# EasyEDA schematic ir_homekit_1.0.json
TITLE: Sheet_1; REV: 1.0; Date: 2022-09-18; Sheet: 1/1; Company: Your Company
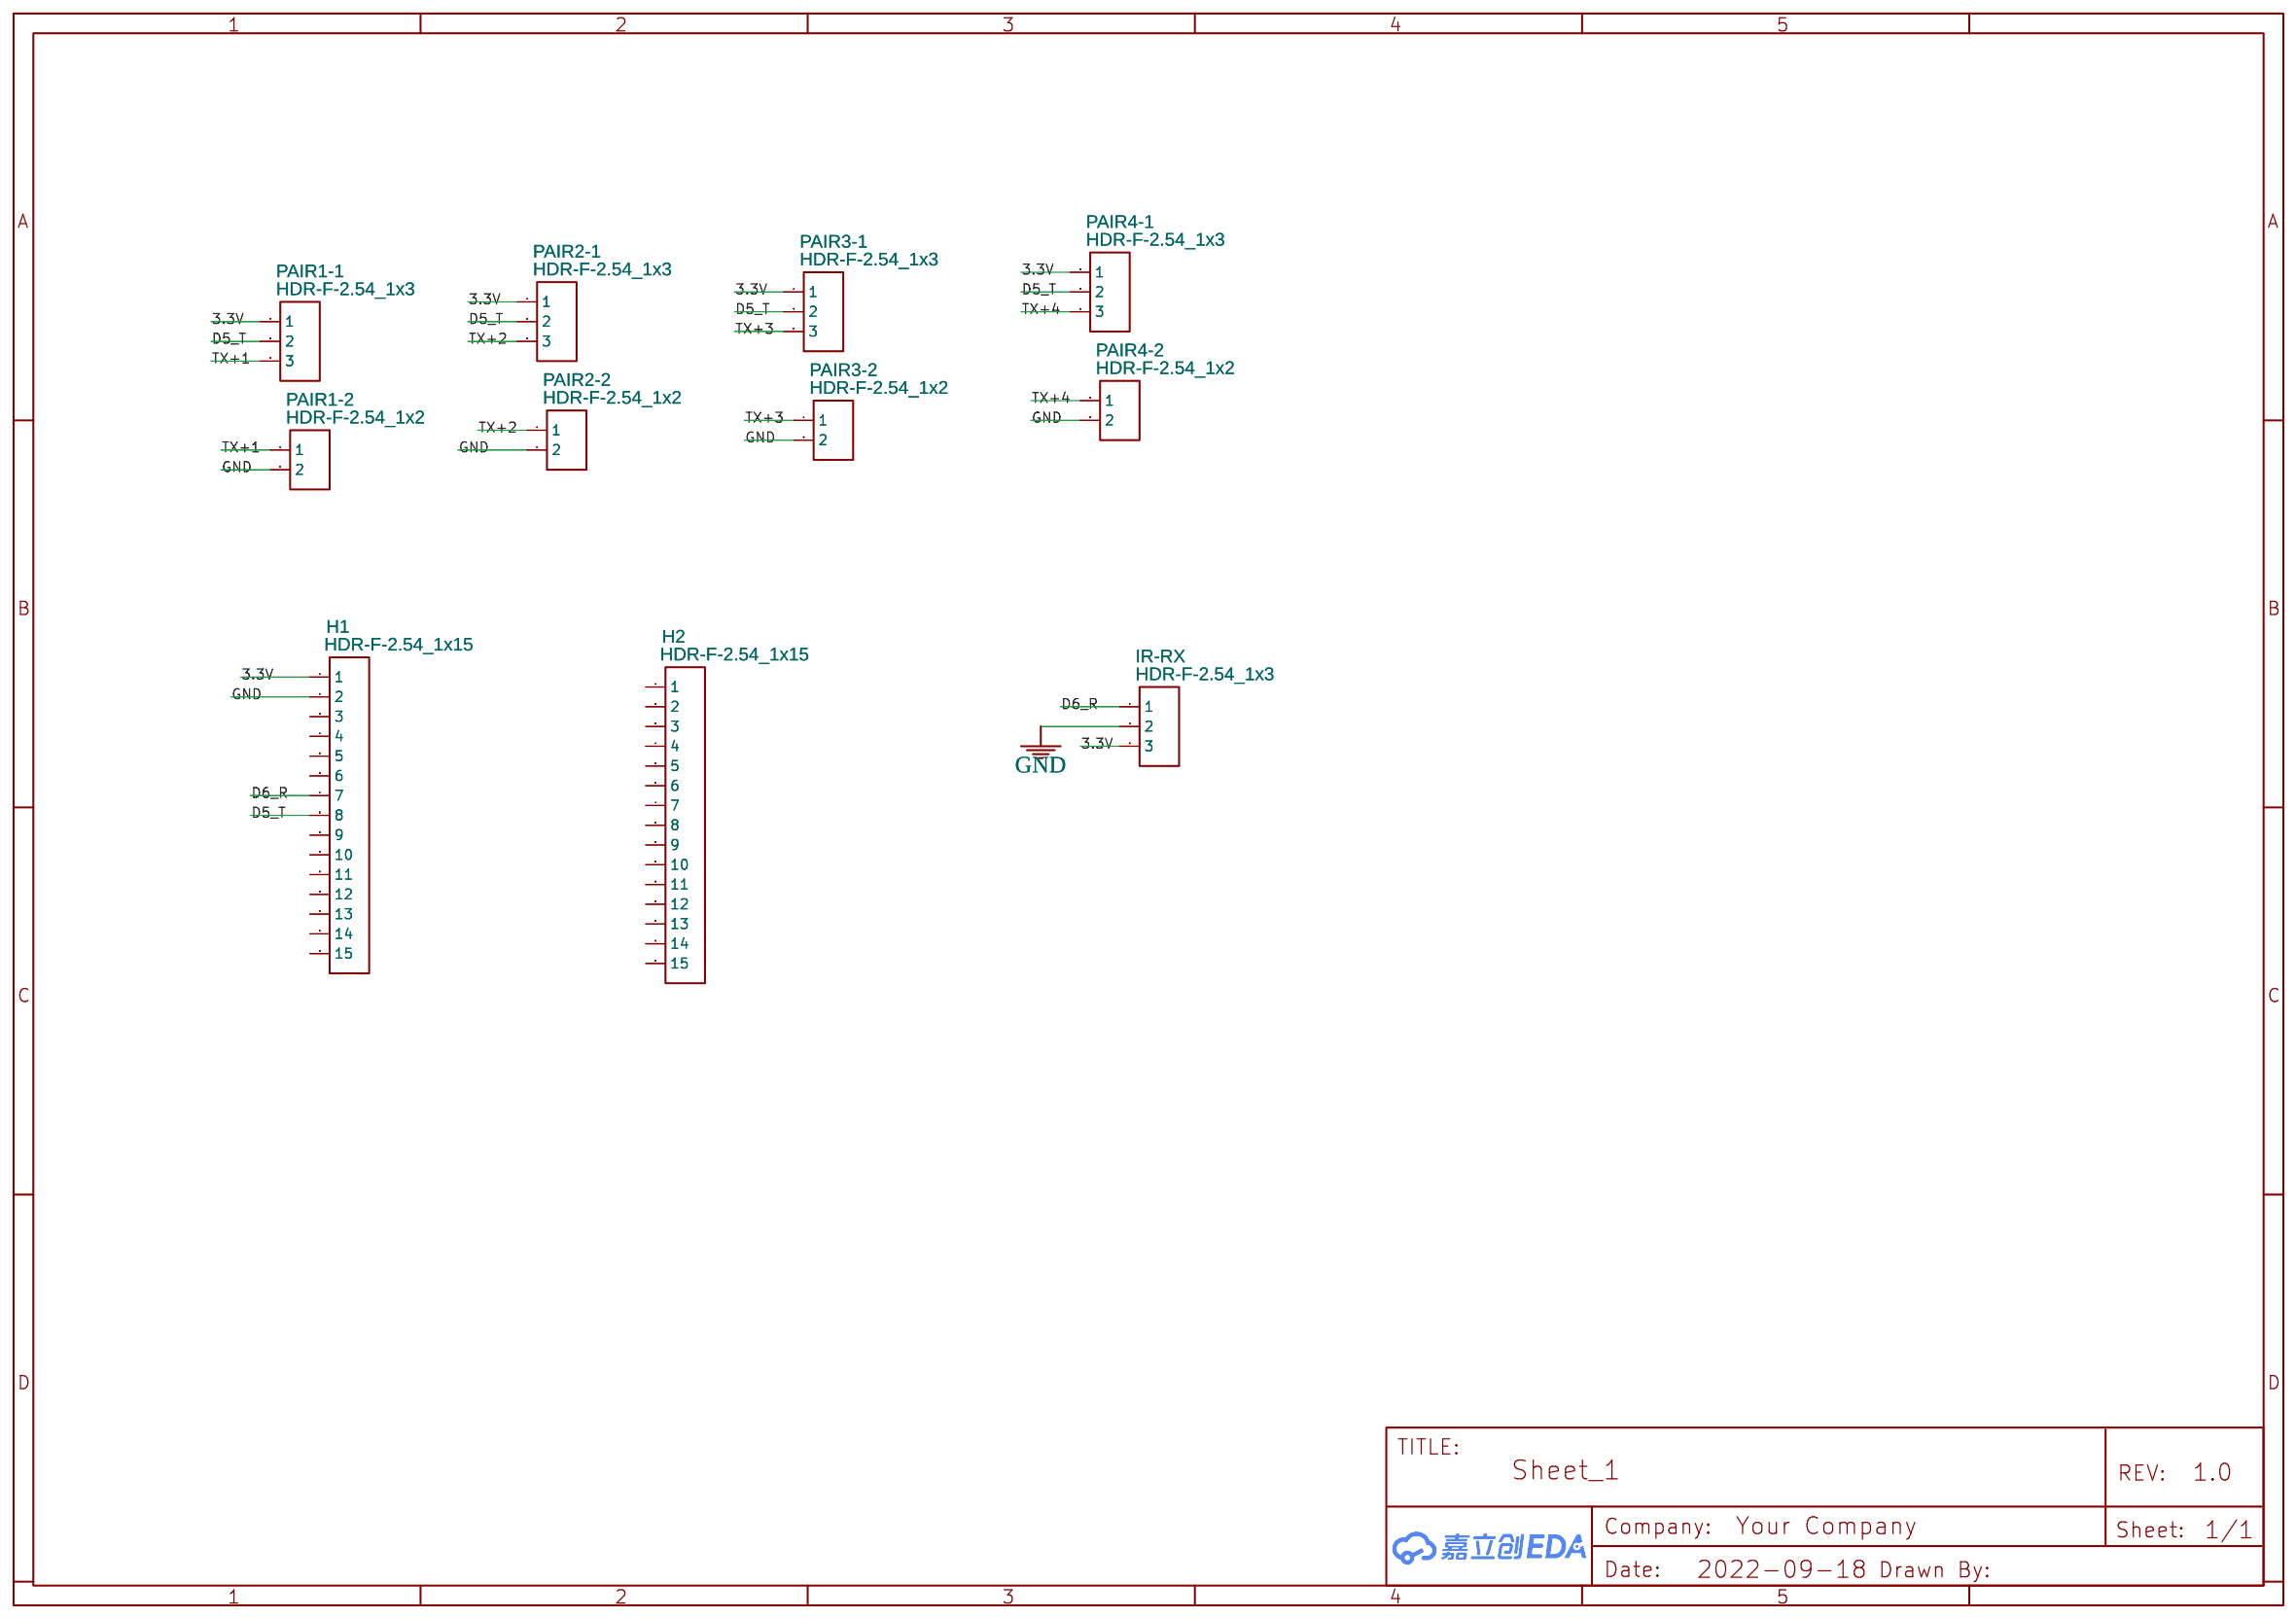
[diagram p0: schematic sheet]

## Parts
H1  HDR-F-2.54_1x15  [HDR-F-2.54_1X15]
H2  HDR-F-2.54_1x15  [HDR-F-2.54_1X15]
IR-RX  HDR-F-2.54_1x3  [HDR-F-2.54_1X3]
PAIR1-1  HDR-F-2.54_1x3  [HDR-F-2.54_1X3]
PAIR1-2  HDR-F-2.54_1x2  [HDR-F-2.54_1X2]
PAIR2-1  HDR-F-2.54_1x3  [HDR-F-2.54_1X3]
PAIR2-2  HDR-F-2.54_1x2  [HDR-F-2.54_1X2]
PAIR3-1  HDR-F-2.54_1x3  [HDR-F-2.54_1X3]
PAIR3-2  HDR-F-2.54_1x2  [HDR-F-2.54_1X2]
PAIR4-1  HDR-F-2.54_1x3  [HDR-F-2.54_1X3]
PAIR4-2  HDR-F-2.54_1x2  [HDR-F-2.54_1X2]

## Library data of the parts
H1 H2 = HDR-F-2.54_1x15: Supplier Part: C124408; Supplier: LCSC; Contributor: LCEDA_Lib
IR-RX PAIR1-1 PAIR2-1 PAIR3-1 PAIR4-1 = HDR-F-2.54_1x3: Supplier Part: C146690; Supplier: LCSC; Contributor: LCEDA_Lib
PAIR1-2 PAIR2-2 PAIR3-2 PAIR4-2 = HDR-F-2.54_1x2: Supplier Part: C49661; Supplier: LCSC; Contributor: LCEDA_Lib

## Nets
3.3V: H1.1 IR-RX.3 PAIR1-1.1 PAIR2-1.1 PAIR3-1.1 PAIR4-1.1
GND: H1.2 IR-RX.2 PAIR1-2.2 PAIR2-2.2 PAIR3-2.2 PAIR4-2.2
D5_T: H1.8 PAIR1-1.2 PAIR2-1.2 PAIR3-1.2 PAIR4-1.2
D6_R: H1.7 IR-RX.1
TX+1: PAIR1-1.3 PAIR1-2.1
TX+2: PAIR2-1.3 PAIR2-2.1
TX+3: PAIR3-1.3 PAIR3-2.1
TX+4: PAIR4-1.3 PAIR4-2.1

Not connected (* = marked no-connect by the designer): H1 3 4 5 6 9 10 11 12 13 14 15; H2 1 2 3 4 5 6 7 8 9 10 11 12 13 14 15
